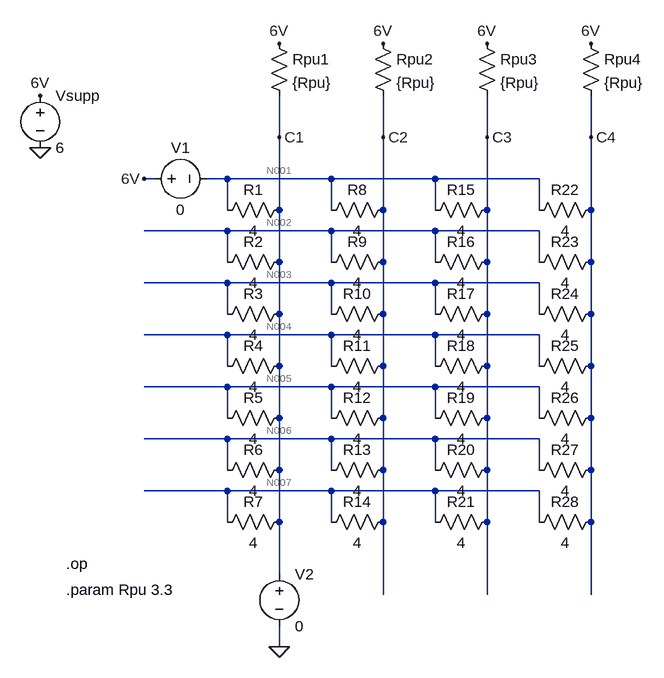
[diagram p0: schematic 7-Segment-Matrix.asc]
7-Segment-Matrix.asc, the LTspice schematic file:
Version 4
SHEET 1 880 788
WIRE 128 -16 128 -80
WIRE 288 -16 288 -80
WIRE 448 -16 448 -80
WIRE 608 -16 608 -80
WIRE -64 48 -80 48
WIRE 48 48 16 48
WIRE 208 48 48 48
WIRE 368 48 208 48
WIRE 528 48 368 48
WIRE 48 96 48 48
WIRE 128 96 128 -16
WIRE 208 96 208 48
WIRE 288 96 288 -16
WIRE 368 96 368 48
WIRE 448 96 448 -16
WIRE 528 96 528 48
WIRE 608 96 608 -16
WIRE 48 128 -80 128
WIRE 208 128 48 128
WIRE 368 128 208 128
WIRE 528 128 368 128
WIRE 48 176 48 128
WIRE 128 176 128 96
WIRE 208 176 208 128
WIRE 288 176 288 96
WIRE 368 176 368 128
WIRE 448 176 448 96
WIRE 528 176 528 128
WIRE 608 176 608 96
WIRE 48 208 -80 208
WIRE 208 208 48 208
WIRE 368 208 208 208
WIRE 528 208 368 208
WIRE 48 256 48 208
WIRE 128 256 128 176
WIRE 208 256 208 208
WIRE 288 256 288 176
WIRE 368 256 368 208
WIRE 448 256 448 176
WIRE 528 256 528 208
WIRE 608 256 608 176
WIRE 48 288 -80 288
WIRE 208 288 48 288
WIRE 368 288 208 288
WIRE 528 288 368 288
WIRE 48 336 48 288
WIRE 128 336 128 256
WIRE 208 336 208 288
WIRE 288 336 288 256
WIRE 368 336 368 288
WIRE 448 336 448 256
WIRE 528 336 528 288
WIRE 608 336 608 256
WIRE 48 368 -80 368
WIRE 208 368 48 368
WIRE 368 368 208 368
WIRE 528 368 368 368
WIRE 48 416 48 368
WIRE 128 416 128 336
WIRE 208 416 208 368
WIRE 288 416 288 336
WIRE 368 416 368 368
WIRE 448 416 448 336
WIRE 528 416 528 368
WIRE 608 416 608 336
WIRE 48 448 -80 448
WIRE 208 448 48 448
WIRE 368 448 208 448
WIRE 528 448 368 448
WIRE 48 496 48 448
WIRE 128 496 128 416
WIRE 208 496 208 448
WIRE 288 496 288 416
WIRE 368 496 368 448
WIRE 448 496 448 416
WIRE 528 496 528 448
WIRE 608 496 608 416
WIRE 48 528 -80 528
WIRE 208 528 48 528
WIRE 368 528 208 528
WIRE 528 528 368 528
WIRE 48 576 48 528
WIRE 128 576 128 496
WIRE 208 576 208 528
WIRE 288 576 288 496
WIRE 368 576 368 528
WIRE 448 576 448 496
WIRE 528 576 528 528
WIRE 608 576 608 496
WIRE 128 656 128 576
WIRE 288 688 288 576
WIRE 448 688 448 576
WIRE 608 688 608 576
WIRE 128 768 128 736
FLAG -240 0 0
FLAG -240 -80 6V
FLAG -80 48 6V
FLAG 128 768 0
FLAG 128 -16 C1
FLAG 288 -16 C2
FLAG 448 -16 C3
FLAG 608 -16 C4
FLAG 288 -160 6V
FLAG 448 -160 6V
FLAG 608 -160 6V
FLAG 128 -160 6V
SYMBOL res 144 80 R90
WINDOW 0 0 56 VBottom 2
WINDOW 3 32 56 VTop 2
SYMATTR InstName R1
SYMATTR Value 4
SYMBOL res 144 160 R90
WINDOW 0 0 56 VBottom 2
WINDOW 3 32 56 VTop 2
SYMATTR InstName R2
SYMATTR Value 4
SYMBOL res 144 240 R90
WINDOW 0 0 56 VBottom 2
WINDOW 3 32 56 VTop 2
SYMATTR InstName R3
SYMATTR Value 4
SYMBOL res 144 320 R90
WINDOW 0 0 56 VBottom 2
WINDOW 3 32 56 VTop 2
SYMATTR InstName R4
SYMATTR Value 4
SYMBOL res 144 400 R90
WINDOW 0 0 56 VBottom 2
WINDOW 3 32 56 VTop 2
SYMATTR InstName R5
SYMATTR Value 4
SYMBOL res 144 480 R90
WINDOW 0 0 56 VBottom 2
WINDOW 3 32 56 VTop 2
SYMATTR InstName R6
SYMATTR Value 4
SYMBOL res 144 560 R90
WINDOW 0 0 56 VBottom 2
WINDOW 3 32 56 VTop 2
SYMATTR InstName R7
SYMATTR Value 4
SYMBOL res 304 80 R90
WINDOW 0 0 56 VBottom 2
WINDOW 3 32 56 VTop 2
SYMATTR InstName R8
SYMATTR Value 4
SYMBOL res 304 160 R90
WINDOW 0 0 56 VBottom 2
WINDOW 3 32 56 VTop 2
SYMATTR InstName R9
SYMATTR Value 4
SYMBOL res 304 240 R90
WINDOW 0 0 56 VBottom 2
WINDOW 3 32 56 VTop 2
SYMATTR InstName R10
SYMATTR Value 4
SYMBOL res 304 320 R90
WINDOW 0 0 56 VBottom 2
WINDOW 3 32 56 VTop 2
SYMATTR InstName R11
SYMATTR Value 4
SYMBOL res 304 400 R90
WINDOW 0 0 56 VBottom 2
WINDOW 3 32 56 VTop 2
SYMATTR InstName R12
SYMATTR Value 4
SYMBOL res 304 480 R90
WINDOW 0 0 56 VBottom 2
WINDOW 3 32 56 VTop 2
SYMATTR InstName R13
SYMATTR Value 4
SYMBOL res 304 560 R90
WINDOW 0 0 56 VBottom 2
WINDOW 3 32 56 VTop 2
SYMATTR InstName R14
SYMATTR Value 4
SYMBOL res 464 80 R90
WINDOW 0 0 56 VBottom 2
WINDOW 3 32 56 VTop 2
SYMATTR InstName R15
SYMATTR Value 4
SYMBOL res 464 160 R90
WINDOW 0 0 56 VBottom 2
WINDOW 3 32 56 VTop 2
SYMATTR InstName R16
SYMATTR Value 4
SYMBOL res 464 240 R90
WINDOW 0 0 56 VBottom 2
WINDOW 3 32 56 VTop 2
SYMATTR InstName R17
SYMATTR Value 4
SYMBOL res 464 320 R90
WINDOW 0 0 56 VBottom 2
WINDOW 3 32 56 VTop 2
SYMATTR InstName R18
SYMATTR Value 4
SYMBOL res 464 400 R90
WINDOW 0 0 56 VBottom 2
WINDOW 3 32 56 VTop 2
SYMATTR InstName R19
SYMATTR Value 4
SYMBOL res 464 480 R90
WINDOW 0 0 56 VBottom 2
WINDOW 3 32 56 VTop 2
SYMATTR InstName R20
SYMATTR Value 4
SYMBOL res 464 560 R90
WINDOW 0 0 56 VBottom 2
WINDOW 3 32 56 VTop 2
SYMATTR InstName R21
SYMATTR Value 4
SYMBOL res 624 80 R90
WINDOW 0 0 56 VBottom 2
WINDOW 3 32 56 VTop 2
SYMATTR InstName R22
SYMATTR Value 4
SYMBOL res 624 160 R90
WINDOW 0 0 56 VBottom 2
WINDOW 3 32 56 VTop 2
SYMATTR InstName R23
SYMATTR Value 4
SYMBOL res 624 240 R90
WINDOW 0 0 56 VBottom 2
WINDOW 3 32 56 VTop 2
SYMATTR InstName R24
SYMATTR Value 4
SYMBOL res 624 320 R90
WINDOW 0 0 56 VBottom 2
WINDOW 3 32 56 VTop 2
SYMATTR InstName R25
SYMATTR Value 4
SYMBOL res 624 400 R90
WINDOW 0 0 56 VBottom 2
WINDOW 3 32 56 VTop 2
SYMATTR InstName R26
SYMATTR Value 4
SYMBOL res 624 480 R90
WINDOW 0 0 56 VBottom 2
WINDOW 3 32 56 VTop 2
SYMATTR InstName R27
SYMATTR Value 4
SYMBOL res 624 560 R90
WINDOW 0 0 56 VBottom 2
WINDOW 3 32 56 VTop 2
SYMATTR InstName R28
SYMATTR Value 4
SYMBOL voltage -240 -96 R0
SYMATTR InstName Vsupp
SYMATTR Value 6
SYMBOL res 272 -176 R0
SYMATTR InstName Rpu2
SYMATTR Value {Rpu}
SYMBOL res 432 -176 R0
SYMATTR InstName Rpu3
SYMATTR Value {Rpu}
SYMBOL res 592 -176 R0
SYMATTR InstName Rpu4
SYMATTR Value {Rpu}
SYMBOL voltage -80 48 R270
WINDOW 0 32 56 VTop 2
WINDOW 3 -32 56 VBottom 2
SYMATTR InstName V1
SYMATTR Value 0
SYMBOL voltage 128 640 R0
WINDOW 123 0 0 Left 2
WINDOW 39 0 0 Left 2
SYMATTR InstName V2
SYMATTR Value 0
SYMBOL res 112 -176 R0
SYMATTR InstName Rpu1
SYMATTR Value {Rpu}
TEXT -200 640 Left 2 !.op
TEXT -200 680 Left 2 !.param Rpu 3.3

The netlist it stands for:
* 7-Segment-Matrix.asc
R1 C1 N001 4
R2 C1 N002 4
R3 C1 N003 4
R4 C1 N004 4
R5 C1 N005 4
R6 C1 N006 4
R7 C1 N007 4
R8 C2 N001 4
R9 C2 N002 4
R10 C2 N003 4
R11 C2 N004 4
R12 C2 N005 4
R13 C2 N006 4
R14 C2 N007 4
R15 C3 N001 4
R16 C3 N002 4
R17 C3 N003 4
R18 C3 N004 4
R19 C3 N005 4
R20 C3 N006 4
R21 C3 N007 4
R22 C4 N001 4
R23 C4 N002 4
R24 C4 N003 4
R25 C4 N004 4
R26 C4 N005 4
R27 C4 N006 4
R28 C4 N007 4
Vsupp 6V 0 6
Rpu2 6V C2 {Rpu}
Rpu3 6V C3 {Rpu}
Rpu4 6V C4 {Rpu}
V1 6V N001 0
V2 C1 0 0
Rpu1 6V C1 {Rpu}
.op
.param Rpu 3.3
.backanno
.end

* Results of the author's LTspice run, read from the files saved beside the schematic
* Operating Point:
*   V(c1) = 0 V
*   V(n001) = 6 V
*   V(n002) = 2.682 V
*   V(n003) = 2.682 V
*   V(n004) = 2.682 V
*   V(n005) = 2.682 V
*   V(n006) = 2.682 V
*   V(n007) = 2.682 V
*   V(c2) = 3.576 V
*   V(c3) = 3.576 V
*   V(c4) = 3.576 V
*   V(6v) = 6 V
*   I(Rpu1) = 1.818 A
*   I(Rpu4) = 734.7 mA
*   I(Rpu3) = 734.7 mA
*   I(Rpu2) = 734.7 mA
*   I(R28) = 223.5 mA
*   I(R27) = 223.5 mA
*   I(R26) = 223.5 mA
*   I(R25) = 223.5 mA
*   I(R24) = 223.5 mA
*   I(R23) = 223.5 mA
*   I(R22) = -606.1 mA
*   I(R21) = 223.5 mA
*   I(R20) = 223.5 mA
*   I(R19) = 223.5 mA
*   I(R18) = 223.5 mA
*   I(R17) = 223.5 mA
*   I(R16) = 223.5 mA
*   I(R15) = -606.1 mA
*   I(R14) = 223.5 mA
*   I(R13) = 223.5 mA
*   I(R12) = 223.5 mA
*   I(R11) = 223.5 mA
*   I(R10) = 223.5 mA
*   I(R9) = 223.5 mA
*   I(R8) = -606.1 mA
*   I(R7) = -670.4 mA
*   I(R6) = -670.4 mA
*   I(R5) = -670.4 mA
*   I(R4) = -670.4 mA
*   I(R3) = -670.4 mA
*   I(R2) = -670.4 mA
*   I(R1) = -1.5 A
*   I(V2) = 7.341 A
*   I(V1) = 3.318 A
*   I(Vsupp) = -7.341 A